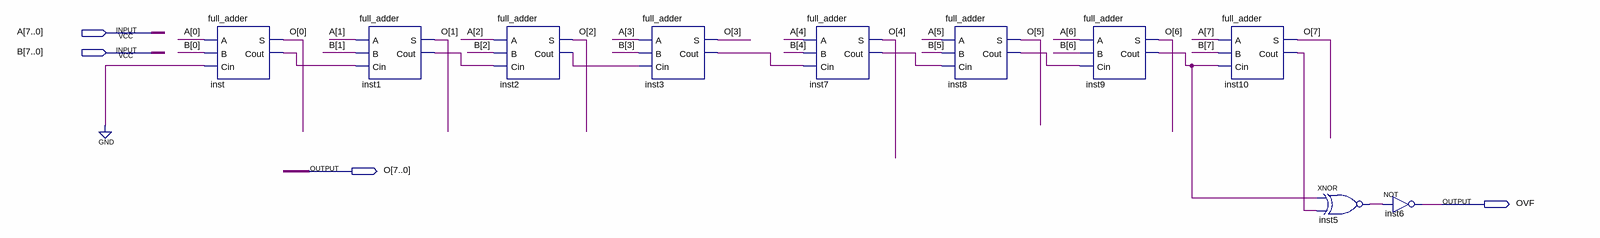
[diagram p0: schematic sheet]
// Quartus schematic FA_8BITS.bdf as structural Verilog: 10 symbols, 4 pins
module FA_8BITS (
  input  [7:0] A,
  input  [7:0] B,
  output [7:0] O,
  output OVF
);

  wire inst1_cout, inst2_cout, inst3_cout, inst5_out, inst7_cout, inst8_cout, inst9_cout, inst10_cout,
       inst_cout;

  full_adder inst (.A(A[0]), .B(B[0]), .Cin(1'b0), .S(O[0]), .Cout(inst_cout));
  full_adder inst1 (.A(A[1]), .B(B[1]), .Cin(inst_cout), .S(O[1]), .Cout(inst1_cout));
  full_adder inst2 (.A(A[2]), .B(B[2]), .Cin(inst1_cout), .S(O[2]), .Cout(inst2_cout));
  full_adder inst3 (.A(A[3]), .B(B[3]), .Cin(inst2_cout), .S(O[3]), .Cout(inst3_cout));
  full_adder inst7 (.A(A[4]), .B(B[4]), .Cin(inst3_cout), .S(O[4]), .Cout(inst7_cout));
  full_adder inst8 (.A(A[5]), .B(B[5]), .Cin(inst7_cout), .S(O[5]), .Cout(inst8_cout));
  full_adder inst9 (.A(A[6]), .B(B[6]), .Cin(inst8_cout), .S(O[6]), .Cout(inst9_cout));
  full_adder inst10 (.A(A[7]), .B(B[7]), .Cin(inst9_cout), .S(O[7]), .Cout(inst10_cout));
  xnor inst5 (inst5_out, inst9_cout, inst10_cout);
  not inst6 (OVF, inst5_out);
endmodule
